# EAGLE design PCB V7 (EAGLE 6.2)
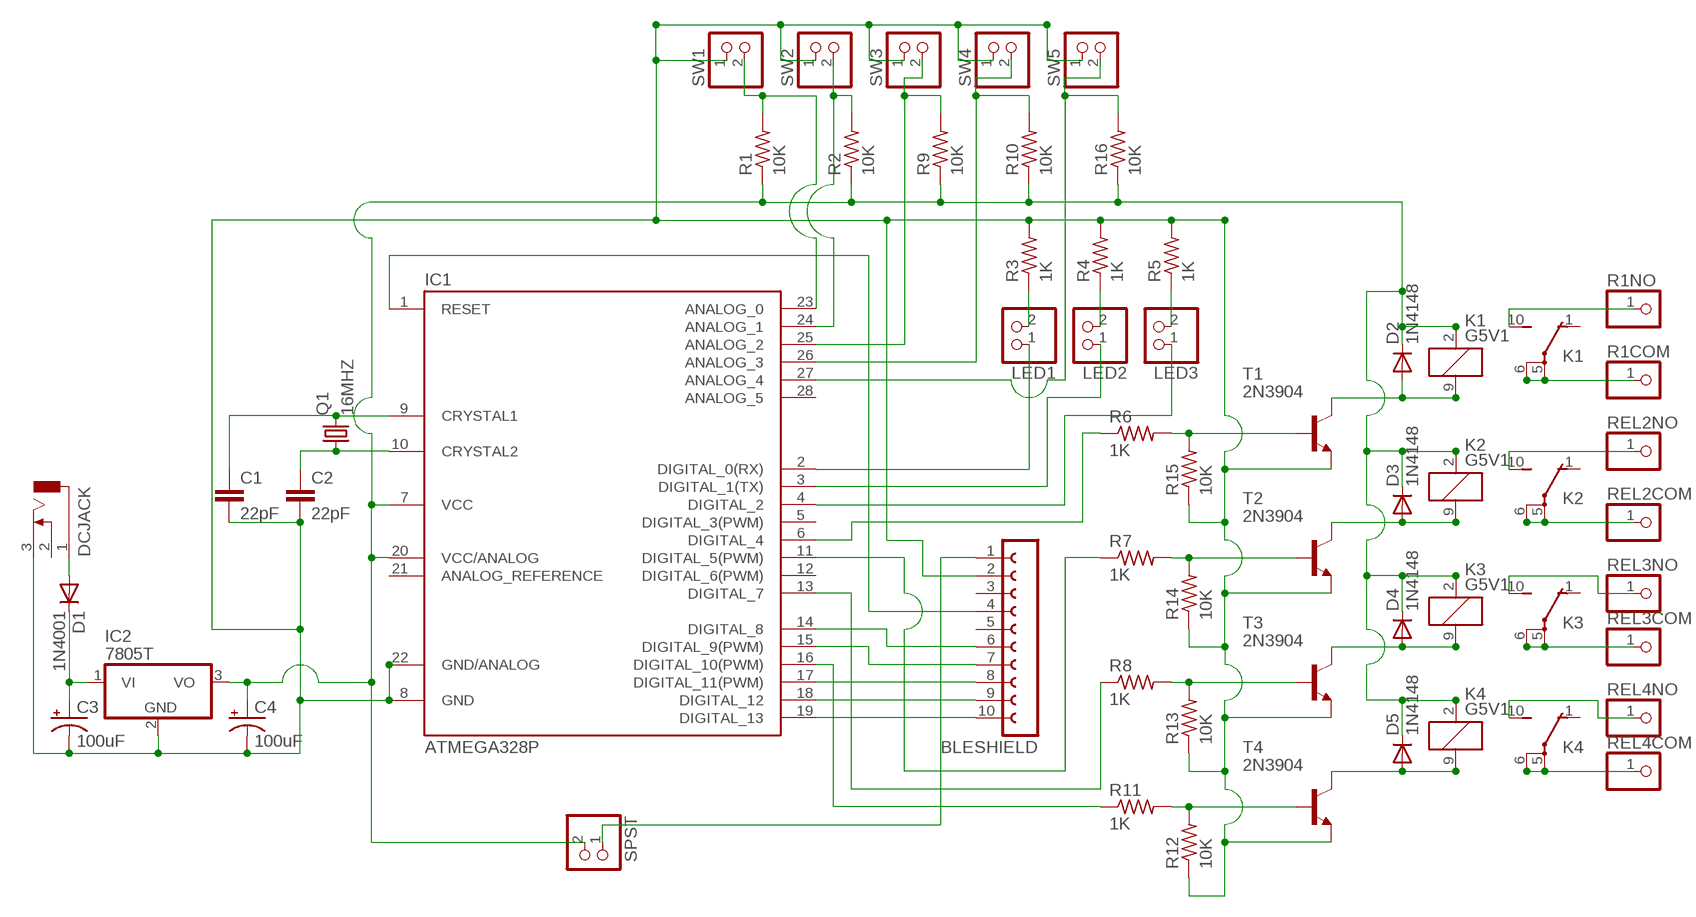
[diagram p0: schematic, sheet 1]

## Parts
BLESHIELD  FE10-1  [FE10]
C1  22pF  C-EU025-030X050  [C025-030X050]
C2  22pF  C-EU025-030X050  [C025-030X050]
C3  100uF  CPOL-USE2.5-6  [E2,5-6]
C4  100uF  CPOL-USE2.5-6  [E2,5-6]
D1  1N4001  1N4004  [DO41-10]
D2  1N4148  1N4148DO35-7  [DO35-7]
D3  1N4148  1N4148DO35-7  [DO35-7]
D4  1N4148  1N4148DO35-7  [DO35-7]
D5  1N4148  1N4148DO35-7  [DO35-7]
DCJACK  DCJ0202  [DCJ0202]
IC1  ATMEGA328P  ATMEGA168-PU  [DIL28-3]
IC2  7805T  [TO220H]
K1  G5V1  [G5V1]
K2  G5V1  [G5V1]
K3  G5V1  [G5V1]
K4  G5V1  [G5V1]
LED1  PINHD-1X2  [1X02]
LED2  PINHD-1X2  [1X02]
LED3  PINHD-1X2  [1X02]
Q1  16MHZ  CRYSTALHC49S  [HC49/S]
R1  10K  R-US_0204/5  [0204/5]
R1COM  PINHD-1X1  [1X01]
R1NO  PINHD-1X1  [1X01]
R2  10K  R-US_0204/5  [0204/5]
R3  1K  R-US_0204/5  [0204/5]
R4  1K  R-US_0204/5  [0204/5]
R5  1K  R-US_0204/5  [0204/5]
R6  1K  R-US_0204/5  [0204/5]
R7  1K  R-US_0204/5  [0204/5]
R8  1K  R-US_0204/5  [0204/5]
R9  10K  R-US_0204/5  [0204/5]
R10  10K  R-US_0204/5  [0204/5]
R11  1K  R-US_0204/5  [0204/5]
R12  10K  R-US_0204/5  [0204/5]
R13  10K  R-US_0204/5  [0204/5]
R14  10K  R-US_0204/5  [0204/5]
R15  10K  R-US_0204/5  [0204/5]
R16  10K  R-US_0204/5  [0204/5]
REL2COM  PINHD-1X1  [1X01]
REL2NO  PINHD-1X1  [1X01]
REL3COM  PINHD-1X1  [1X01]
REL3NO  PINHD-1X1  [1X01]
REL4COM  PINHD-1X1  [1X01]
REL4NO  PINHD-1X1  [1X01]
SPST  PINHD-1X2  [1X02]
SW1  PINHD-1X2  [1X02]
SW2  PINHD-1X2  [1X02]
SW3  PINHD-1X2  [1X02]
SW4  PINHD-1X2  [1X02]
SW5  PINHD-1X2  [1X02]
T1  2N3904  [TO92]
T2  2N3904  [TO92]
T3  2N3904  [TO92]
T4  2N3904  [TO92]

## Nets
GND: BLESHIELD.2 C1.2 C2.2 C3.- C4.- DCJACK.3 IC1.8(GND) IC1.22(GND/ANALOG) IC2.2(GND) R3.2 R4.2 R5.2 R12.1 R13.1 R14.1 R15.1 SW1.1 SW2.1 SW3.1 SW4.1 SW5.1 T1.3(E) T2.3(E) T3.3(E) T4.3(E)
N$1: BLESHIELD.10 IC1.19(DIGITAL_13)
N$2: R6.2 R15.2 T1.2(B)
N$3: IC1.3(DIGITAL_1(TX)) LED2.1
N$4: BLESHIELD.6 IC1.14(DIGITAL_8)
N$5: C1.1 IC1.9(CRYSTAL1) Q1.2
N$6: C2.1 IC1.10(CRYSTAL2) Q1.1
N$7: IC1.24(ANALOG_1) R2.2 SW2.2
N$8: C3.+ D1.C IC2.1(VI)
N$9: BLESHIELD.4 IC1.1(RESET)
N$10: BLESHIELD.7 IC1.15(DIGITAL_9(PWM))
N$11: BLESHIELD.8 IC1.17(DIGITAL_11(PWM))
N$12: BLESHIELD.9 IC1.18(DIGITAL_12)
N$13: D3.A K2.9 T2.1(C)
N$14: R7.2 R14.2 T2.2(B)
N$15: IC1.23(ANALOG_0) R1.2 SW1.2
N$16: D2.A K1.9 T1.1(C)
N$17: LED1.2 R3.1
N$18: LED2.2 R4.1
N$19: LED3.2 R5.1
N$20: C4.+ D2.C D3.C D4.C D5.C IC1.7(VCC) IC1.20(VCC/ANALOG) IC2.3(VO) K1.2 K2.2 K3.2 K4.2 R1.1 R2.1 R9.1 R10.1 R16.1 SPST.2
N$21: IC1.27(ANALOG_4) R16.2 SW5.2
N$22: K1.5(2:P) K1.6(2:P) R1COM.1
N$23: K1.10(2:S) R1NO.1
N$24: IC1.16(DIGITAL_10(PWM)) R11.1
N$25: IC1.25(ANALOG_2) R9.2 SW3.2
N$26: IC1.6(DIGITAL_4) R6.1
N$27: D1.A DCJACK.1
N$28: IC1.26(ANALOG_3) R10.2 SW4.2
N$29: IC1.2(DIGITAL_0(RX)) LED1.1
N$30: BLESHIELD.1 SPST.1
N$31: K2.10(2:S) REL2NO.1
N$32: K2.5(2:P) K2.6(2:P) REL2COM.1
N$33: K3.5(2:P) K3.6(2:P) REL3COM.1
N$34: IC1.13(DIGITAL_7) R8.1
N$36: IC1.11(DIGITAL_5(PWM)) R7.1
N$38: K3.10(2:S) REL3NO.1
N$39: K4.10(2:S) REL4NO.1
N$40: K4.5(2:P) K4.6(2:P) REL4COM.1
N$41: R8.2 R13.2 T3.2(B)
N$42: IC1.4(DIGITAL_2) LED3.1
N$43: D4.A K3.9 T3.1(C)
N$47: R11.2 R12.2 T4.2(B)
N$48: D5.A K4.9 T4.1(C)
Unconnected: BLESHIELD.3 BLESHIELD.5 DCJACK.2 IC1.5(DIGITAL_3(PWM)) IC1.12(DIGITAL_6(PWM)) IC1.21(ANALOG_REFERENCE) IC1.28(ANALOG_5) K1.1(2:O) K2.1(2:O) K3.1(2:O) K4.1(2:O)

## Library data of the parts
BLESHIELD = con-lsta:FE10-1: FEMALE HEADER; OC_FARNELL: unknown; OC_NEWARK: unknown
C1 C2 = rcl:C-EU: CAPACITOR, European symbol
C3 C4 = rcl:CPOL-US: POLARIZED CAPACITOR, American symbol
D1 = diode:1N4004: DIODE general purpose rectifier, 1 A
D2-D5 = diode:1N4148: DIODE high speed (Philips)
DCJACK = con-jack:DCJ0202: DC POWER JACK Source: DCJ0202.pdf; OC_FARNELL: unknown; OC_NEWARK: unknown
IC1 = Arduino-AVR:ATMEGA168-PU
IC2 = linear:78*: Positive VOLTAGE REGULATOR Source: http://cache.national.com/ds/LM/LM78L05.pdf http://www.fairchildsemi.com/ds/LM/LM7805.pdf
K1-K4 = relay:G5V1: RELAY 1 x switch, 0.5 A/125 V AC, 1 A/24 V DC , Omron; MPN: G5V-1-DC24; OC_FARNELL: 9949593; OC_NEWARK: 36M6377
LED1-LED3 SPST SW1-SW5 = pinhead:PINHD-1X2: PIN HEADER
Q1 = crystal:CRYSTAL: CRYSTAL; OC_FARNELL: 1667008; OC_NEWARK: unknown
R1-R16 = resistor:R-US_: RESISTOR, American symbol
R1COM R1NO REL2COM REL2NO REL3COM REL3NO REL4COM REL4NO = pinhead:PINHD-1X1: PIN HEADER
T1-T4 = transistor:2N3904: NPN TRANSISTOR

## Net classes
0 default: width 0.305 mm, drill 0.508 mm, clearance 0.254 mm

## Board
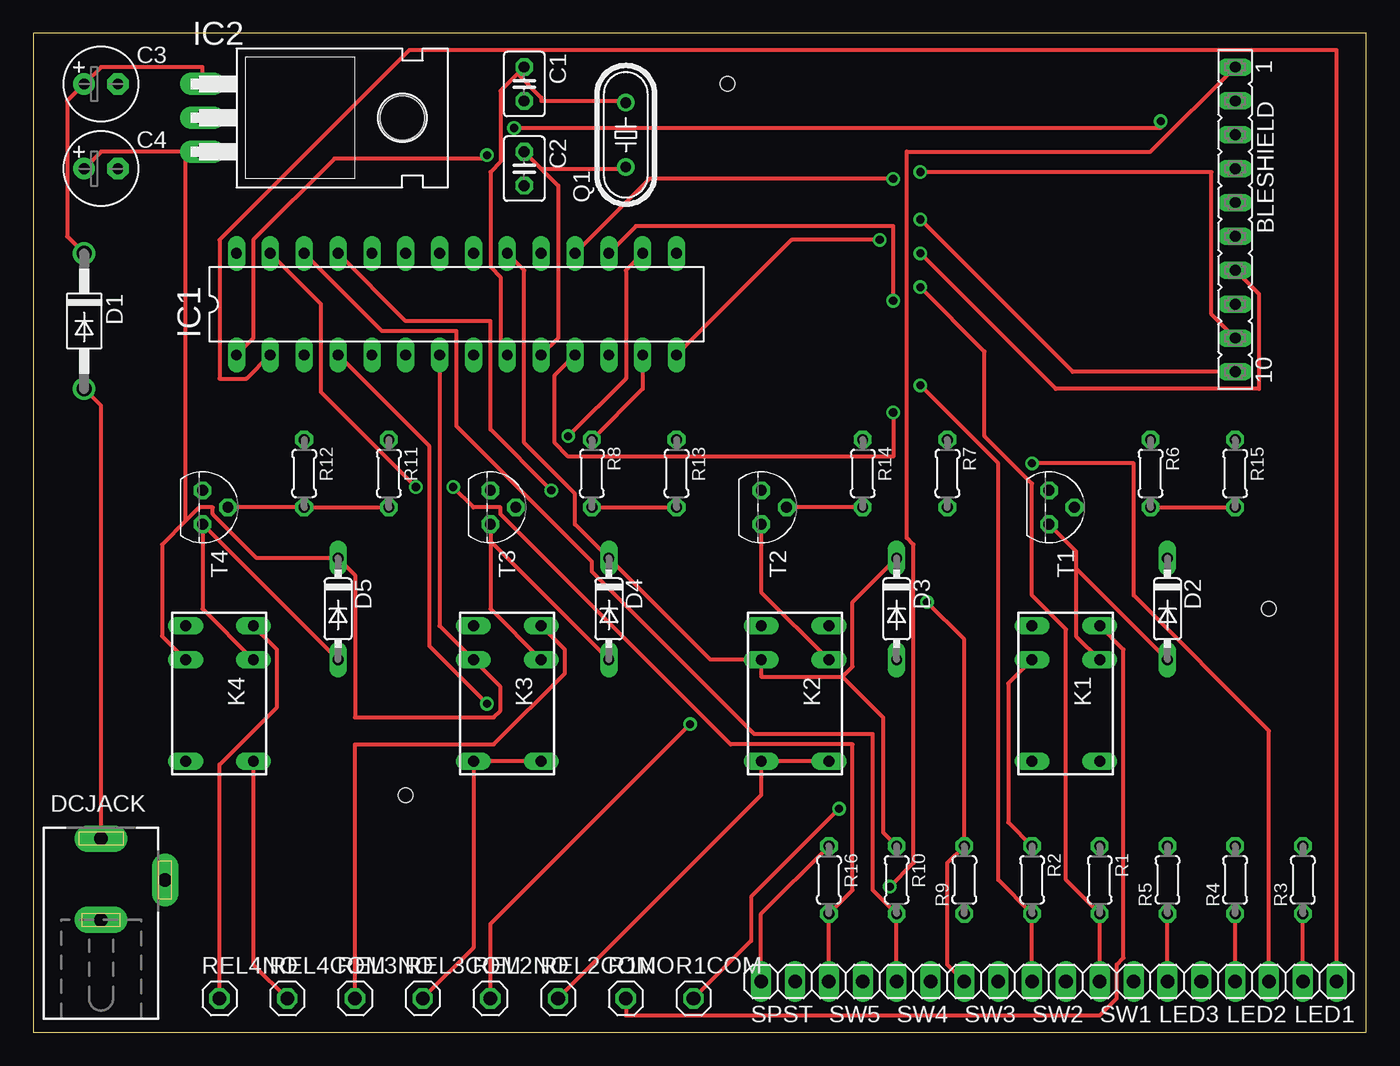
[diagram p1: board, top side]
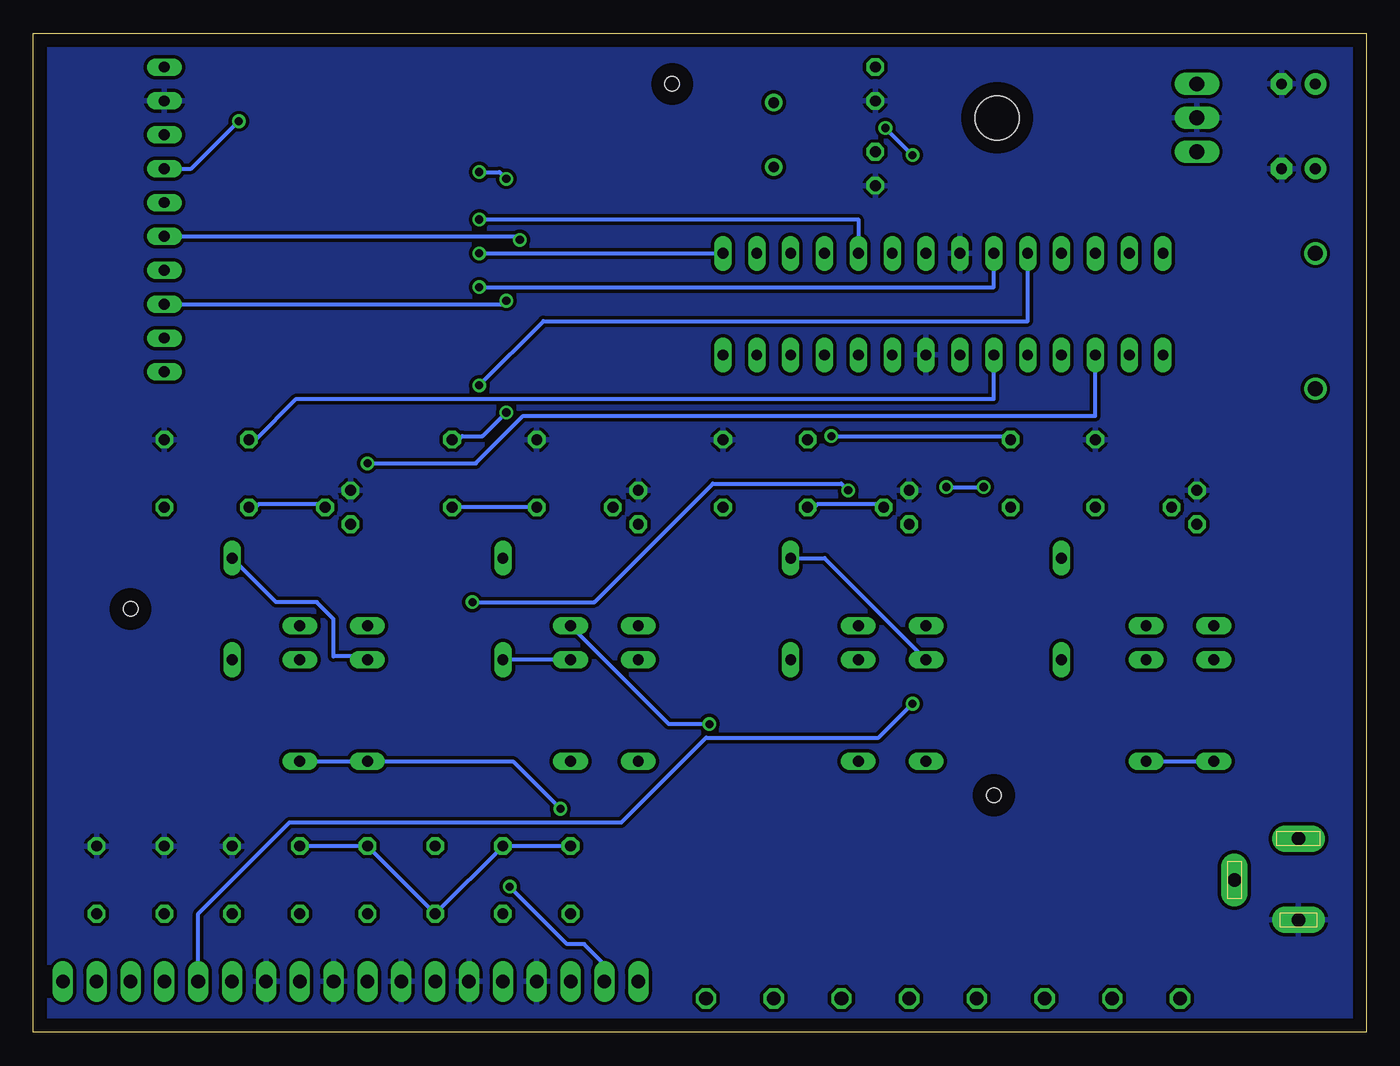
[diagram p2: board, bottom side, seen from below]

Size 100 x 74.92 mm. Coordinates in mm from the lower left corner, seen from the top.
Outline: 0,0 100,0 100,74.92 0,74.92 0,0
Copper layers (1*16): Top 0.035mm / dielectric 1.5mm / Bottom 0.035mm
Design rules: minimum track width 10mil, minimum drill 24mil, track to track 8mil, track to pad 8mil, pad to pad 8mil, via to via 8mil, smd to smd 8mil, copper to edge 40mil, drill to drill 8mil, minimum pad ring 10mil, minimum via ring 8mil, stop-mask expansion 4mil, vias tented up to drill 0mil, thermal gap 10mil
Holes 1.1 mm at 92.71,31.75 27.94,17.78 52.07,71.12

### Footprints (pad centres in the part's own frame; a part is rotated, then mirrored left to right if it is on the bottom)
FE10 = drill 0.813 long: 1 -11.43,0; 2 -8.89,0; 3 -6.35,0; 4 -3.81,0; 5 -1.27,0; 6 1.27,0; 7 3.81,0; 8 6.35,0; 9 8.89,0; 10 11.43,0
C025-030X050 = drill 0.813 octagon: 1 -1.27,0; 2 1.27,0
E2,5-6 = drill 0.813 pad 1.6: + -1.27,0 | drill 0.813 pad 1.6 octagon: - 1.27,0
DO41-10 = drill 1.118: A 5.08,0; C -5.08,0
DO35-7 = drill 0.813 long: A 3.81,0; C -3.81,0
DCJ0202 = drill 1 pad 2 long: 1 0,3.1; 2 4.8,0; 3 0,-3
DIL28-3 = drill 0.813 long: 1 -16.51,-3.81; 2 -13.97,-3.81; 3 -11.43,-3.81; 4 -8.89,-3.81; 5 -6.35,-3.81; 6 -3.81,-3.81; 7 -1.27,-3.81; 8 1.27,-3.81; 9 3.81,-3.81; 10 6.35,-3.81; 11 8.89,-3.81; 12 11.43,-3.81; 13 13.97,-3.81; 14 16.51,-3.81; 15 16.51,3.81; 16 13.97,3.81; 17 11.43,3.81; 18 8.89,3.81; 19 6.35,3.81; 20 3.81,3.81; 21 1.27,3.81; 22 -1.27,3.81; 23 -3.81,3.81; 24 -6.35,3.81; 25 -8.89,3.81; 26 -11.43,3.81; 27 -13.97,3.81; 28 -16.51,3.81
TO220H = drill 1.118 long: 1 -2.54,-10.16; 2 0,-10.16; 3 2.54,-10.16 | hole 3.302: 0,4.826
G5V1 = drill 0.813 long: 1 -5.08,-2.54; 2 -2.54,-2.54; 5 5.08,-2.54; 6 5.08,2.54; 9 -2.54,2.54; 10 -5.08,2.54
1X02 = drill 1.016 long: 1 -1.27,0; 2 1.27,0
HC49/S = drill 0.813: 1 -2.413,0; 2 2.413,0
0204/5 = drill 0.813 octagon: 1 -2.54,0; 2 2.54,0
1X01 = drill 1.016 octagon: 1 0,0
TO92 = drill 0.813 octagon: 1 1.27,0; 2 0,1.905; 3 -1.27,0

### Placement (x,y rotation side)
BLESHIELD  90.17,60.96 270 top
C1  36.83,71.12 270 top
C2  36.83,64.77 270 top
C3  5.08,71.12 0 top
C4  5.08,64.77 0 top
D1  3.81,53.34 270 top
D2  85.09,31.75 270 top
D3  64.77,31.75 270 top
D4  43.18,31.75 270 top
D5  22.86,31.75 270 top
DCJACK  5.08,11.43 0 top
IC1  31.75,54.61 0 top
IC2  22.86,68.58 270 top
K1  77.47,25.4 270 top
K2  57.15,25.4 270 top
K3  35.56,25.4 270 top
K4  13.97,25.4 270 top
LED1  96.52,3.81 180 top
LED2  91.44,3.81 180 top
LED3  86.36,3.81 180 top
Q1  44.45,67.31 90 top
R1  80.01,11.43 270 top
R1COM  49.53,2.54 0 top
R1NO  44.45,2.54 0 top
R2  74.93,11.43 270 top
R3  95.25,11.43 90 top
R4  90.17,11.43 90 top
R5  85.09,11.43 90 top
R6  83.82,41.91 270 top
R7  68.58,41.91 270 top
R8  41.91,41.91 270 top
R9  69.85,11.43 90 top
R10  64.77,11.43 270 top
R11  26.67,41.91 270 top
R12  20.32,41.91 270 top
R13  48.26,41.91 270 top
R14  62.23,41.91 270 top
R15  90.17,41.91 270 top
R16  59.69,11.43 270 top
REL2COM  39.37,2.54 0 top
REL2NO  34.29,2.54 0 top
REL3COM  29.21,2.54 0 top
REL3NO  24.13,2.54 0 top
REL4COM  19.05,2.54 0 top
REL4NO  13.97,2.54 0 top
SPST  55.88,3.81 180 top
SW1  81.28,3.81 180 top
SW2  76.2,3.81 180 top
SW3  71.12,3.81 180 top
SW4  66.04,3.81 180 top
SW5  60.96,3.81 180 top
T1  76.2,39.37 270 top
T2  54.61,39.37 270 top
T3  34.29,39.37 270 top
T4  12.7,39.37 270 top

### Tracks (layer width: path | path; a pad name or v marks a point on that pad's centre or on a via)
GND
  pour Bottom: 0,74.93 99.06,74.93 99.06,0 0,0
N$1  (via drill 0.61)
  Top 0.305: v66.55,60.96 77.98,49.53 BLESHIELD.10
  Bottom 0.305: IC1.19 38.1,60.96 v66.55,60.96
N$2
  Top 0.305: R6.2 R15.2
  Bottom 0.305: R6.2 83.31,39.37 83.06,39.62 78.49,39.62 78.23,39.37 T1.2
N$3  (via drill 0.61)
  Top 0.305: v74.93,42.67 82.55,42.67 82.55,32.77 92.71,22.61 LED2.1
  Bottom 0.305: IC1.3 20.32,46.23 63.25,46.23 66.8,42.67 v74.93,42.67
N$4  (via drill 0.61)
  Top 0.305: IC1.14 56.9,59.44 v63.5,59.44
  Bottom 0.305: v63.5,59.44 63.75,59.69 BLESHIELD.6
N$5
  Top 0.305: IC1.9 35.05,51.31 35.05,56.64 34.29,57.4 34.29,64.52 35.05,65.28 35.05,70.61 36.32,71.88 | C1.1 36.32,71.88 | 36.32,71.88 38.1,70.1 38.1,69.85 44.45,69.85 Q1.2
N$6
  Top 0.305: IC1.10 39.37,52.07 39.37,63.5 38.1,64.77 | C2.1 38.1,64.77 | 38.1,64.77 44.45,64.77 Q1.1
N$7  (via drill 0.61)
  Top 0.305: SW2.2 R2.2 72.39,11.43 72.39,42.67 v66.55,48.51
  Bottom 0.305: IC1.24 25.4,53.34 61.72,53.34 v66.55,48.51
N$8
  Top 0.305: IC2.1 12.7,72.39 5.08,72.39 C3.+ 2.54,69.85 2.54,59.69 D1.C
N$9  (via drill 0.61)
  Top 0.305: IC1.1 16.51,52.07 16.51,59.44 22.61,65.53 34.04,65.53 v34.04,65.79 | v36.07,67.82 84.58,67.82 v84.58,68.33
  Bottom 0.305: v36.07,67.82 v34.04,65.79 | v84.58,68.33 88.14,64.77 BLESHIELD.4
N$10  (via drill 0.61)
  Top 0.305: v66.55,58.42 76.71,48.26 91.95,48.26 91.95,55.37 BLESHIELD.7
  Bottom 0.305: v66.55,58.42 IC1.15
N$11  (via drill 0.61)
  Top 0.305: IC1.17 45.21,60.45 64.52,60.45 v64.52,54.86
  Bottom 0.305: v64.52,54.86 64.77,54.61 BLESHIELD.8
N$12  (via drill 0.61)
  Top 0.305: IC1.18 46.23,64.01 v64.52,64.01 | v66.55,64.52 88.39,64.52 88.39,53.85 BLESHIELD.9
  Bottom 0.305: v64.52,64.01 65.02,64.52 v66.55,64.52
N$13
  Top 0.305: K2.9 54.61,33.02 T2.1
  Bottom 0.305: K2.9 D3.A
N$14
  Top 0.305: R14.2 T2.2
  Bottom 0.305: R14.2 R7.2
N$15  (via drill 0.61)
  Top 0.305: SW1.2 R1.2 77.47,11.43 77.47,30.23 74.93,32.77 74.93,41.15 71.37,44.7 71.37,51.05 v66.55,55.88
  Bottom 0.305: IC1.23 27.94,55.88 v66.55,55.88
N$16
  Top 0.305: K1.9 78.23,29.72 78.23,34.8 | 78.23,34.8 78.23,36.07 T1.1 | 78.23,34.8 D2.A
N$17
  Top 0.305: LED1.2 R3.1
N$18
  Top 0.305: LED2.2 R4.1
N$19
  Top 0.305: LED3.2 R5.1
N$20
  Top 0.305: IC1.7 30.48,30.48 K3.2 35.05,25.91 35.05,24.13 34.54,23.62 24.13,23.62 24.13,34.29 D5.C 16.76,35.56 13.46,38.86 13.46,39.37 12.45,39.37 11.43,38.35 | C4.+ 5.08,66.04 11.43,66.04 | K4.2 9.65,29.72 9.65,36.58 11.43,38.35 | 11.43,38.35 11.43,66.04 | 11.43,66.04 IC2.3 | R2.1 73.15,15.75 73.15,26.16 K1.2 | R16.1 54.61,8.89 SPST.2 | IC1.20 36.83,57.15 36.83,44.2 40.64,40.39 40.64,38.1 D4.C 50.8,27.94 K2.2 54.61,26.67 60.71,26.67 | D3.C 61.47,32.26 61.47,27.43 60.71,26.67 | R10.1 63.75,14.99 63.75,23.62 60.71,26.67
  Bottom 0.305: R1.1 R2.1 R9.1 R10.1 R16.1 | D2.C 81.79,32.26 78.74,32.26 77.47,30.99 77.47,28.19 75.18,28.19 K1.2 | K3.2 40.64,35.56 D4.C
N$21  (via drill 0.61)
  Top 0.305: SW5.2 R16.2 61.47,10.67 61.47,21.59 52.32,21.59 35.05,38.86 35.05,39.37 33.02,39.37 v31.5,40.89 | IC1.27 21.59,54.61 21.59,48.01 v28.7,40.89
  Bottom 0.305: v31.5,40.89 v28.7,40.89
N$22  (via drill 0.61)
  Top 0.305: R1COM.1 53.85,6.86 53.85,10.16 v60.45,16.76
  Bottom 0.305: K1.6 K1.5 64.01,20.32 v60.45,16.76
N$23
  Top 0.305: K1.10 81.79,28.7 81.79,5.59 81.28,5.08 81.28,2.54 80.01,1.27 44.45,1.27 R1NO.1
N$24  (via drill 0.61)
  Top 0.305: v40.13,44.7 44.45,49.02 44.45,57.15 IC1.16
  Bottom 0.305: R11.1 26.92,44.7 v40.13,44.7
N$25  (via drill 0.61)
  Top 0.305: SW3.2 68.58,5.08 68.58,12.7 R9.2 69.85,29.46 v67.06,32.26 | IC1.25 27.94,53.34 34.29,53.34 34.29,45.21 v38.86,40.64
  Bottom 0.305: v38.86,40.64 39.37,41.15 49.02,41.15 57.91,32.26 v67.06,32.26
N$26
  Bottom 0.305: IC1.6 27.94,47.5 80.26,47.5 83.31,44.45 R6.1
N$27
  Top 0.305: D1.A 5.08,46.99 DCJACK.1
N$28
  Top 0.305: SW4.2 R10.2 62.99,10.67 62.99,22.35 54.1,22.35 41.91,34.54 41.91,35.31 31.75,45.47 31.75,52.58 26.16,52.58 IC1.26
N$29
  Top 0.305: IC1.2 16,49.02 13.97,49.02 13.97,59.44 28.19,73.66 97.79,73.66 LED1.1
N$30  (via drill 0.61)
  Top 0.305: BLESHIELD.1 83.82,66.04 65.53,66.04 65.53,37.08 66.04,36.58 66.04,12.7 v64.26,10.92
  Bottom 0.305: v64.26,10.92 59.94,6.6 58.67,6.6 57.15,5.08 SPST.1
N$31  (via drill 0.61)
  Top 0.305: v49.28,23.11 34.29,8.13 REL2NO.1
  Bottom 0.305: K2.10 52.32,23.11 v49.28,23.11
N$32
  Top 0.305: K2.6 K2.5 54.61,17.78 REL2COM.1
N$33
  Top 0.305: K3.6 K3.5 33.02,6.35 REL3COM.1
N$34
  Top 0.305: R8.1 45.72,48.26 IC1.13
N$36  (via drill 0.61)
  Top 0.305: IC1.11 39.12,49.28 39.12,44.2 40.13,43.18 64.52,43.18 v64.52,46.48
  Bottom 0.305: v64.52,46.48 66.29,44.7 67.82,44.7 68.07,44.45 R7.1
N$38
  Top 0.305: K3.10 39.88,28.7 39.88,26.92 34.54,21.59 24.13,21.59 REL3NO.1
N$39
  Top 0.305: K4.10 18.29,28.7 18.29,24.38 13.97,20.07 REL4NO.1
N$40
  Top 0.305: REL4COM.1 16.51,5.08 K4.6
  Bottom 0.305: K4.6 K4.5
N$41
  Top 0.305: R8.2 R13.2
  Bottom 0.305: R8.2 41.4,39.37 41.15,39.62 36.58,39.62 36.32,39.37 T3.2
N$42  (via drill 0.61)
  Top 0.305: IC1.4 29.72,43.94 29.72,28.96 v34.04,24.64
  Bottom 0.305: v34.04,24.64 36.58,22.1 49.53,22.1 55.88,15.75 80.77,15.75 87.63,8.89 LED3.1
N$43
  Top 0.305: K3.9 34.29,31.75 34.29,36.83 | T3.1 34.29,36.83 | 34.29,36.83 D4.A
N$47
  Top 0.305: T4.2 R12.2 R11.2
N$48
  Top 0.305: K4.9 12.7,31.75 T4.1 D5.A